# EAGLE board ElektorLinuxBoard_V3.01 (EAGLE 6.4)
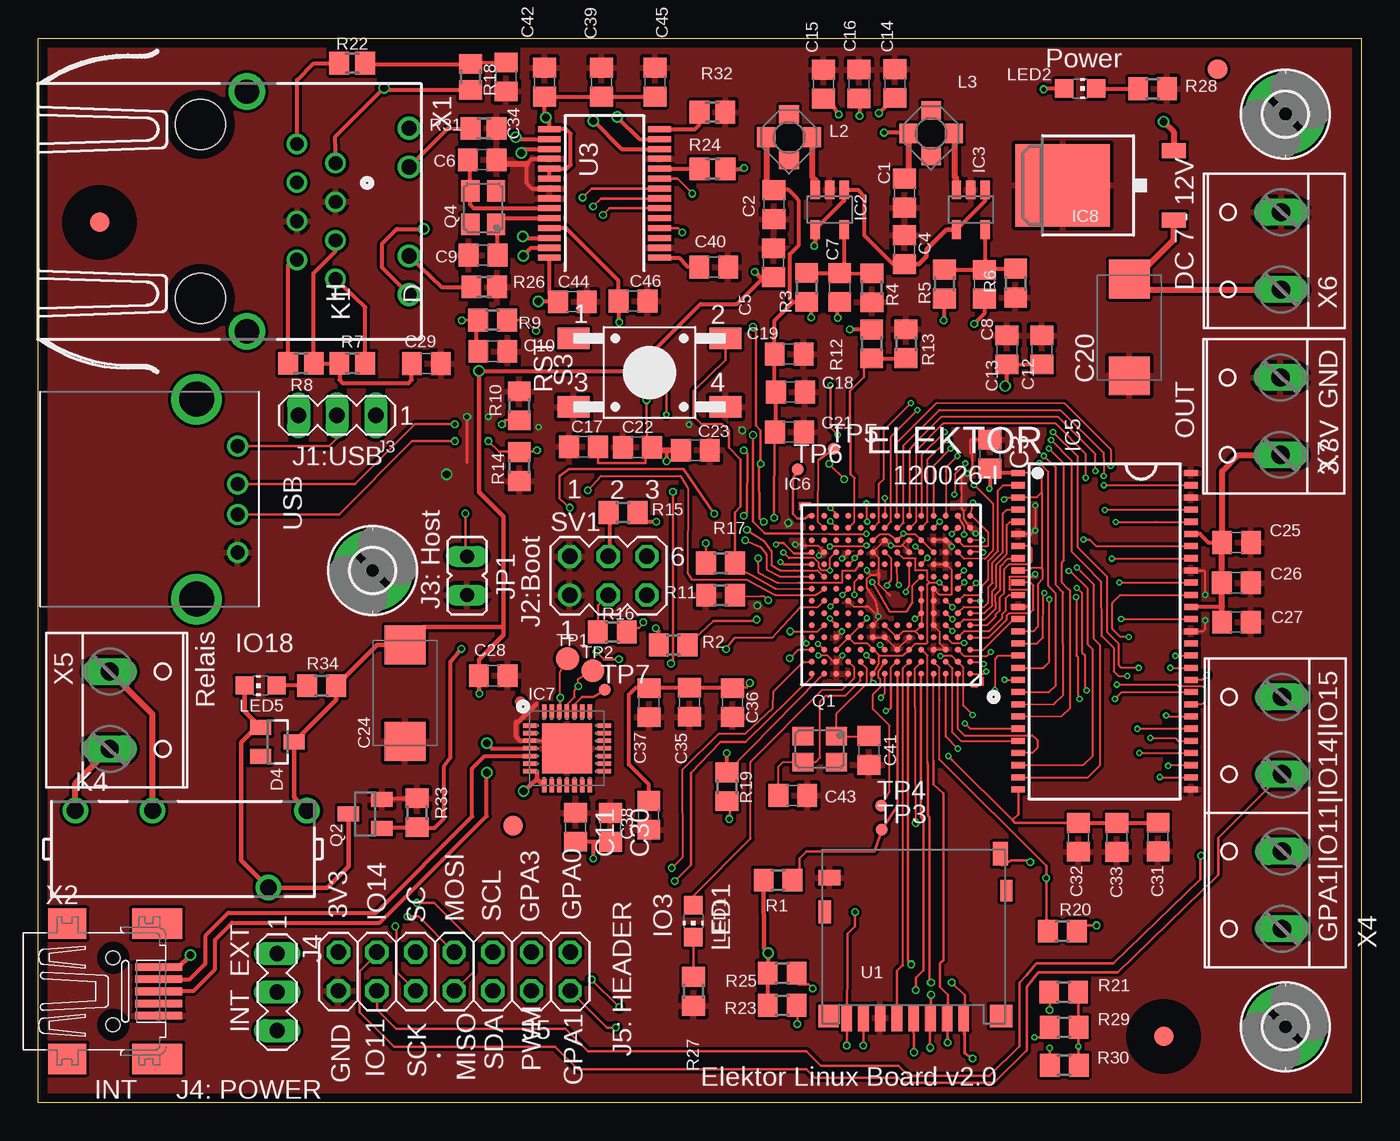
[diagram p3: board, top side]
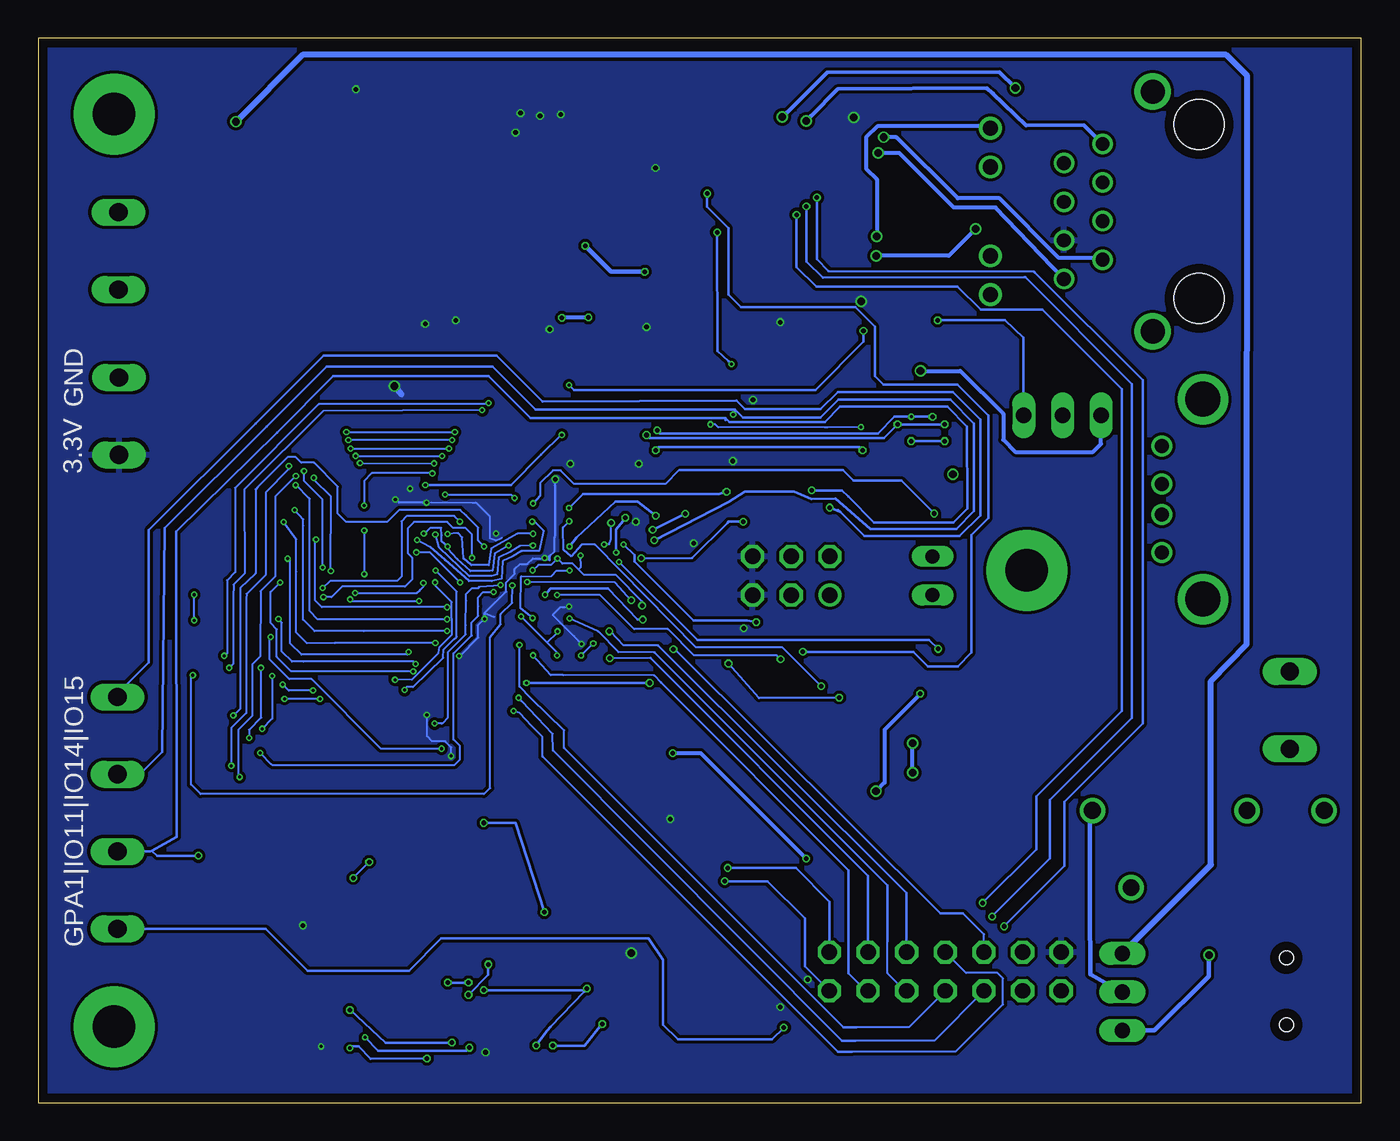
[diagram p4: board, bottom side, seen from below]

Size 87 x 70 mm. Coordinates in mm from the lower left corner, seen from the top.
Outline: 0,70 87,70 87,0 0,0 0,70
Copper layers (1*16): Top 0.035mm / dielectric 0.1mm / Bottom 0.035mm
Design rules "default *": minimum track width 0.12mm, minimum drill 0.2mm, track to track 0.12mm, track to pad 0.12mm, pad to pad 0.12mm, via to via 0.12mm, smd to smd 0mil, copper to edge 0.6mm, drill to drill 8mil, minimum pad ring 6mil, minimum via ring 4mil, stop-mask expansion 2mil, vias tented up to drill 40mil, thermal gap 10mil
Net classes: 0 default: width 0.2 mm, drill 0.3 mm, clearance 0.2 mm; 1 500mA: width 0.3 mm, drill 0.3 mm, clearance 0.15 mm

## Footprints (pad centres in the part's own frame; a part is rotated, then mirrored left to right if it is on the bottom)
C0805 = smd 1.3 x 1.5: 1 -0.95,0; 2 0.95,0
D/7343-31R = smd 2.55 x 2.7: + 3.175,0; - -3.175,0
DIODE_SOT23 = smd 1 x 1.4: 1 -0.95,-1.1; 2 0.95,-1.1; 3 0,1.1
PASSERMARKEN_FIDUCIAL = smd 1.27 x 1.27: 1 0,0
2,8-PAD = drill 2.8 pad 5.334 round: B2,8 0,0
TSOT23 = smd 0.622 x 1.22: 1 -0.95,-1.31; 2 0,-1.31; 3 0.95,-1.31; 4 0.95,1.31; 5 -0.95,1.31
TSOPII = smd 0.4 x 0.9: 1 1.03,0.67; 2 1.83,0.67; 3 2.63,0.67; 4 3.43,0.67; 5 4.23,0.67; 6 5.03,0.67; 7 5.83,0.67; 8 6.63,0.67; 9 7.43,0.67; 10 8.23,0.67; 11 9.03,0.67; 12 9.83,0.67; 13 10.63,0.67; 14 11.43,0.67; 15 12.23,0.67; 16 13.03,0.67; 17 13.83,0.67; 18 14.63,0.67; 19 15.43,0.67; 20 16.23,0.67; 21 17.03,0.67; 22 17.83,0.67; 23 18.63,0.67; 24 19.43,0.67; 25 20.23,0.67; 26 21.03,0.67; 27 21.83,0.67; 28 21.83,12.03; 29 21.03,12.03; 30 20.23,12.03; 31 19.43,12.03; 32 18.63,12.03; 33 17.83,12.03; 34 17.03,12.03; 35 16.23,12.03; 36 15.43,12.03; 37 14.63,12.03; 38 13.83,12.03; 39 13.03,12.03; 40 12.23,12.03; 41 11.43,12.03; 42 10.63,12.03; 43 9.83,12.03; 44 9.03,12.03; 45 8.23,12.03; 46 7.43,12.03; 47 6.63,12.03; 48 5.83,12.03; 49 5.03,12.03; 50 4.23,12.03; 51 3.43,12.03; 52 2.63,12.03; 53 1.83,12.03; 54 1.03,12.03
TFBGA180 = smd 0.4 x 0.4: A1 -5.2,5.2; A2 -4.4,5.2; A3 -3.6,5.2; A4 -2.8,5.2; A5 -2,5.2; A6 -1.2,5.2; A7 -0.4,5.2; A8 0.4,5.2; A9 1.2,5.2; A10 2,5.2; A11 2.8,5.2; A12 3.6,5.2; A13 4.4,5.2; A14 5.2,5.2; B1 -5.2,4.4; B2 -4.4,4.4; B3 -3.6,4.4; B4 -2.8,4.4; B5 -2,4.4; B6 -1.2,4.4; B7 -0.4,4.4; B8 0.4,4.4; B9 1.2,4.4; B10 2,4.4; B11 2.8,4.4; B12 3.6,4.4; B13 4.4,4.4; B14 5.2,4.4; C1 -5.2,3.6; C2 -4.4,3.6; C3 -3.6,3.6; C4 -2.8,3.6; C5 -2,3.6; C6 -1.2,3.6; C7 -0.4,3.6; C8 0.4,3.6; C9 1.2,3.6; C10 2,3.6; C11 2.8,3.6; C12 3.6,3.6; C13 4.4,3.6; C14 5.2,3.6; D1 -5.2,2.8; D2 -4.4,2.8; D3 -3.6,2.8; D4 -2.8,2.8; D5 -2,2.8; D6 -1.2,2.8; D7 -0.4,2.8; D8 0.4,2.8; D9 1.2,2.8; D10 2,2.8; D11 2.8,2.8; D12 3.6,2.8; D13 4.4,2.8; D14 5.2,2.8; E1 -5.2,2; E2 -4.4,2; E3 -3.6,2; E4 -2.8,2; E5 -2,2; E6 -1.2,2; E7 -0.4,2; E8 0.4,2; E9 1.2,2; E10 2,2; E11 2.8,2; E12 3.6,2; E13 4.4,2; E14 5.2,2; F1 -5.2,1.2; F2 -4.4,1.2; F3 -3.6,1.2; F4 -2.8,1.2; F5 -2,1.2; F10 2,1.2; F11 2.8,1.2; F12 3.6,1.2; F13 4.4,1.2; F14 5.2,1.2; G1 -5.2,0.4; G2 -4.4,0.4; G3 -3.6,0.4; G4 -2.8,0.4; G5 -2,0.4; G10 2,0.4; G11 2.8,0.4; G12 3.6,0.4; G13 4.4,0.4; G14 5.2,0.4; H1 -5.2,-0.4; H2 -4.4,-0.4; H3 -3.6,-0.4; H4 -2.8,-0.4; H5 -2,-0.4; H10 2,-0.4; H11 2.8,-0.4; H12 3.6,-0.4; H13 4.4,-0.4; H14 5.2,-0.4; J1 -5.2,-1.2; J2 -4.4,-1.2; J3 -3.6,-1.2; J4 -2.8,-1.2; J5 -2,-1.2; J10 2,-1.2; J11 2.8,-1.2; J12 3.6,-1.2; J13 4.4,-1.2; J14 5.2,-1.2; K1 -5.2,-2; K2 -4.4,-2; K3 -3.6,-2; K4 -2.8,-2; K5 -2,-2; K6 -1.2,-2; K7 -0.4,-2; K8 0.4,-2; K9 1.2,-2; K10 2,-2; K11 2.8,-2; K12 3.6,-2; K13 4.4,-2; K14 5.2,-2; L1 -5.2,-2.8; L2 -4.4,-2.8; L3 -3.6,-2.8; L4 -2.8,-2.8; L5 -2,-2.8; L6 -1.2,-2.8; L7 -0.4,-2.8; L8 0.4,-2.8; L9 1.2,-2.8; L10 2,-2.8; L11 2.8,-2.8; L12 3.6,-2.8; L13 4.4,-2.8; L14 5.2,-2.8; M1 -5.2,-3.6; M2 -4.4,-3.6; M3 -3.6,-3.6; M4 -2.8,-3.6; M5 -2,-3.6; M6 -1.2,-3.6; M7 -0.4,-3.6; M8 0.4,-3.6; M9 1.2,-3.6; M10 2,-3.6; M11 2.8,-3.6; M12 3.6,-3.6; M13 4.4,-3.6; M14 5.2,-3.6; N1 -5.2,-4.4; N2 -4.4,-4.4; N3 -3.6,-4.4; N4 -2.8,-4.4; N5 -2,-4.4; N6 -1.2,-4.4; N7 -0.4,-4.4; N8 0.4,-4.4; N9 1.2,-4.4; N10 2,-4.4; N11 2.8,-4.4; N12 3.6,-4.4; N13 4.4,-4.4; N14 5.2,-4.4; P1 -5.2,-5.2; P2 -4.4,-5.2; P3 -3.6,-5.2; P4 -2.8,-5.2; P5 -2,-5.2; P6 -1.2,-5.2; P7 -0.4,-5.2; P8 0.4,-5.2; P9 1.2,-5.2; P10 2,-5.2; P11 2.8,-5.2; P12 3.6,-5.2; P13 4.4,-5.2; P14 5.2,-5.2
MLP28 = smd 0.9 x 0.3: 1 -2.45,1.5; 2 -2.45,1; 3 -2.45,0.5; 4 -2.45,0; 5 -2.45,-0.5; 6 -2.45,-1; 7 -2.45,-1.5; 15 2.45,-1.5; 16 2.45,-1; 17 2.45,-0.5; 18 2.45,0; 19 2.45,0.5; 20 2.45,1; 21 2.45,1.5 | smd 0.3 x 0.9: 8 -1.5,-2.45; 9 -1,-2.45; 10 -0.5,-2.45; 11 0,-2.45; 12 0.5,-2.45; 13 1,-2.45; 14 1.5,-2.45; 22 1.5,2.45; 23 1,2.45; 24 0.5,2.45; 25 0,2.45; 26 -0.5,2.45; 27 -1,2.45; 28 -1.5,2.45 | smd 3.3 x 3.3: EXP 0,0
DPACK_3 = smd 1 x 1.6: 1 -2.28,-4.8; 3 2.28,-4.8 | smd 5.4 x 6.2: 4 0,2.5
MA03-1 = drill 1.016 long: 1 -2.54,0; 2 0,0; 3 2.54,0
2X07 = drill 1.016 octagon: 1 -7.62,-1.27; 2 -7.62,1.27; 3 -5.08,-1.27; 4 -5.08,1.27; 5 -2.54,-1.27; 6 -2.54,1.27; 7 0,-1.27; 8 0,1.27; 9 2.54,-1.27; 10 2.54,1.27; 11 5.08,-1.27; 12 5.08,1.27; 13 7.62,-1.27; 14 7.62,1.27
JP1 = drill 0.914 long: 1 0,-1.27; 2 0,1.27
61400416021 = drill 0.92 round: 1 -3.5,2.7; 2 -1,2.7; 3 1,2.7; 4 3.5,2.7 | drill 2.3 round: 5 -6.57,0; 6 6.57,0
RELAY_G6D = drill 1.1 pad 1.676 round: 1 8.08,2.5; 5 -2.08,2.5; 7 -7.16,2.5; 13 5.54,-2.58
PSU3014 = smd 1.2 x 1.3: 1 -1.5,0; 2 1.5,0 | smd 1.3 x 1.2: 3 0,1.5; 4 0,-1.5
CHIP-LED0805 = smd 1.2 x 1.2: A 0,-1.05; C 0,1.05
SX-32 = smd 1.4 x 1.2: 1 -1.1,-0.85; 2 1.1,-0.85; 3 1.1,0.85; 4 -1.1,0.85
TRANSISTOR-SMALL-SIGNAL_SOT23 = smd 1 x 1.4: 1 -0.95,-1.1; 2 0.95,-1.1; 3 0,1.1
R0805 = smd 1.3 x 1.5: 1 -0.95,0; 2 0.95,0
R0805' = smd 1.3 x 1.5: 1 -0.85,0; 2 0.85,0
TASTER-9314_SMD = smd 2.1 x 1.4: 1 -5,2.25; 2 5,2.25; 3 -5,-2.25; 4 5,-2.25
MA03-2 = drill 1.016 round: 1 -2.54,-1.27 | drill 1.016 octagon: 2 -2.54,1.27; 3 0,-1.27; 4 0,1.27; 5 2.54,-1.27; 6 2.54,1.27
TP15R = smd 1.5 x 1.5: TP 0,0
TP08R = smd 0.8 x 0.8: TP 0,0
DM3D-SF = smd 0.7 x 1.75: 1 7.7,-0.875; 2 6.6,-0.875; 3 5.5,-0.875; 4 4.4,-0.875; 5 3.3,-0.875; 6 2.2,-0.875; 7 1.1,-0.875; 8 0,-0.875 | smd 1.3 x 1.5: P$1 -1.2,-0.75 | smd 1.5 x 1.5: P$10 10.15,-0.75 | smd 0.8 x 1.4: P$11 10.5,7.5 | smd 0.8 x 1.5: P$13 -1.45,6.1 | smd 1 x 1.55: SW_A 10.1,9.925 | smd 1.45 x 1: SW_B -1.125,8.35
SSOP28 = smd 0.4 x 1.5: 1 -4.225,-3.625; 2 -3.575,-3.625; 3 -2.925,-3.625; 4 -2.275,-3.625; 5 -1.625,-3.625; 6 -0.975,-3.625; 7 -0.325,-3.625; 8 0.325,-3.625; 9 0.975,-3.625; 10 1.625,-3.625; 11 2.275,-3.625; 12 2.925,-3.625; 13 3.575,-3.625; 14 4.225,-3.625; 15 4.225,3.625; 16 3.575,3.625; 17 2.925,3.625; 18 2.275,3.625; 19 1.625,3.625; 20 0.975,3.625; 21 0.325,3.625; 22 -0.325,3.625; 23 -0.975,3.625; 24 -1.625,3.625; 25 -2.275,3.625; 26 -2.925,3.625; 27 -3.575,3.625; 28 -4.225,3.625
J1 = drill 0.9 pad 1.3 round: 1 4.445,2.54; 2 3.175,0; 3 1.905,2.54; 4 0.635,0; 5 -0.635,2.54; 6 -1.905,0; 7 -3.175,2.54; 8 -4.445,0 | drill 1 pad 1.422 round: 9 5.465,7.37; 10 2.925,7.37; 11 -2.925,7.37; 12 -5.465,7.37 | drill 1.6 pad 2.184 round: M1 -7.875,-3.3; M2 7.875,-3.3 | hole 3.3: 5.715,-6.35; -5.715,-6.35
32005-201 = smd 3.1 x 0.5: 1 3,1.6; 2 3,0.8; 3 3,0; 4 3,-0.8; 5 3,-1.6 | smd 2.5 x 2: M1 -3,-4.45; M2 -3,4.45 | smd 3.3 x 2: M3 2.9,4.45; M4 2.9,-4.45 | hole 0.9: 0,2.2; 0,-2.2
W237-4P = drill 1.194 long: 1 -7.62,-0.635; 2 -2.54,-0.635; 3 2.54,-0.635; 4 7.62,-0.635
W237-132 = drill 1.194 long: 1 -2.54,-0.635; 2 2.54,-0.635

## Placement (x,y rotation side)
C1  10uF  [C0805]  56.96,59.8 90 top
C2  10uF  [C0805]  48.37,59.04 90 top
C3  100nF  [C0805]  62.58,42.64 270 top
C4  4.7uF  [C0805]  56.96,56.08 90 top
C5  4.7uF  [C0805]  48.35,55.22 90 top
C6  22pF  [C0805]  29.2,61.99 180 top
C7  22pF  [C0805]  52.7,53.6 90 top
C8  22pF  [C0805]  62.22,53.81 90 top
C9  22pF  [C0805]  29.25,55.72 0 top
C10  100nF  [C0805]  29.9,49.4 180 top
C11  100nF  [C0805]  35.34,18.12 270 top
C12  3.3nF  [C0805]  66,49.5 270 top
C13  10uF  [C0805]  63.7,49.5 270 top
C14  10uF  [C0805]  56.33,67.01 270 top
C15  3.3nF  [C0805]  51.62,66.97 270 top
C16  100nF  [C0805]  53.97,66.98 270 top
C17  3.3nF  [C0805]  35.86,43.13 0 top
C18  100nF  [C0805]  49.47,46.72 180 top
C19  3.3nF  [C0805]  49.38,49.23 180 top
C20  10uF  [D/7343-31R]  71.73,50.97 90 top
C21  10uF  [C0805]  49.39,44.1 180 top
C22  100nF  [C0805]  39.41,43.09 0 top
C23  10uF  [C0805]  43.21,42.9 180 top
C24  10uF  [D/7343-31R]  24.14,26.93 90 top
C25  3.3nF  [C0805]  78.79,36.83 180 top
C26  100nF  [C0805]  78.78,34.19 180 top
C27  10uF  [C0805]  78.78,31.6 180 top
C28  2.2uF  [C0805]  29.92,28.08 0 top
C29  100nF  [C0805]  25.53,48.6 0 top
C30  10uF  [C0805]  37.63,18.11 270 top
C31  3.3nF  [C0805]  73.63,17.47 90 top
C32  10uF  [C0805]  68.39,17.46 90 top
C33  100nF  [C0805]  70.92,17.44 90 top
C34  100nF  [C0805]  30.76,67.44 90 top
C35  100nF  [C0805]  42.82,26.33 90 top
C36  3.3nF  [C0805]  45.66,26.31 90 top
C37  10uF  [C0805]  40.17,26.3 90 top
C38  100nF  [C0805]  40.14,18.9 90 top
C39  100nF  [C0805]  37.04,67.09 90 top
C40  10uF  [C0805]  44.42,54.94 0 top
C41  22pF  [C0805]  54.62,23.17 90 top
C42  100nF  [C0805]  33.3,67.09 90 top
C43  22pF  [C0805]  49.62,20.2 180 top
C44  100nF  [C0805]  35.13,52.66 0 top
C45  100nF  [C0805]  40.56,67.1 90 top
C46  100nF  [C0805]  39.11,52.7 0 top
D4  BAT54  [DIODE_SOT23]  15.74,23.73 270 top
FID1  [PASSERMARKEN_FIDUCIAL]  4.05,57.89 0 top
FID2  [PASSERMARKEN_FIDUCIAL]  74,4.36 0 top
FID3  [PASSERMARKEN_FIDUCIAL]  31.24,18.22 0 top
FID4  [PASSERMARKEN_FIDUCIAL]  77.54,67.95 0 top
H1  MOUNT-PAD-ROUND2.8  [2,8-PAD]  82,5 0 top
H2  MOUNT-PAD-ROUND2.8  [2,8-PAD]  22,35 0 top
H4  MOUNT-PAD-ROUND2.8  [2,8-PAD]  82,65 0 top
IC2  AS1324  [TSOT23]  52.04,58.71 180 top
IC3  AS1324  [TSOT23]  61.32,58.71 180 top
IC5  A43E26161TSOPII  [TSOPII]  63.76,42.43 270 top
IC6  LPC313XFET180  [TFBGA180]  56.07,33.4 180 top
IC7  CP21021  [MLP28]  34.77,23.3 0 top
IC8  MC78M05ABDT  [DPACK_3]  69.86,60.31 90 top
J3  [MA03-1]  19.66,45.19 180 top
J4  [MA03-1]  15.72,7.28 270 top
J5  [2X07]  27.36,8.63 180 top
JP1  [JP1]  28.2,34.65 0 top
K1  61400416021  [61400416021]  10.42,39.68 270 top
K4  G6D-1A-ASI5VDC  [RELAY_G6D]  9.61,16.72 0 top
L2  4u7  [PSU3014]  49.37,63.47 180 top
L3  4u7  [PSU3014]  58.71,63.73 180 top
LED1  ROT  [CHIP-LED0805]  43.08,11.95 180 top
LED2  GRUEN  [CHIP-LED0805]  68.51,66.68 270 top
LED5  GRUEN  [CHIP-LED0805]  14.64,27.43 90 top
Q1  SX-32 - 12 MHz  [SX-32]  51.39,23.25 180 top
Q2  BSS123  [TRANSISTOR-SMALL-SIGNAL_SOT23]  21.51,18.99 90 top
Q4  SX-32 - 25 MHZ  [SX-32]  29.26,58.84 90 top
R1  10K  [R0805]  48.65,14.64 180 top
R2  10K  [R0805]  41.75,30.1 0 top
R3  301K  [R0805]  50.53,53.6 270 top
R4  301K  [R0805]  54.81,53.57 90 top
R5  301K  [R0805]  59.59,53.83 270 top
R6  66K5  [R0805]  64.26,53.88 90 top
R7  49R9  [R0805']  20.66,48.61 0 top
R8  49R9  [R0805']  17.29,48.61 180 top
R9  10K  [R0805]  29.88,51.45 0 top
R10  1M  [R0805]  31.64,45.82 270 top
R11  12K 1%  [R0805]  44.87,33.37 0 top
R12  10K  [R0805]  54.8,49.89 90 top
R13  DNP  [R0805]  57.06,49.9 270 top
R14  1M  [R0805]  31.64,41.83 90 top
R15  10K  [R0805]  38.45,38.8 180 top
R16  10K  [R0805]  37.75,30.95 0 top
R17  10K  [R0805]  44.87,35.48 180 top
R18  49R9  [R0805']  28.44,67.44 90 top
R19  10K  [R0805]  45.29,20.77 90 top
R20  10K  [R0805]  67.33,11.28 180 top
R21  10K  [R0805]  67.42,7.28 180 top
R22  49R9  [R0805']  20.65,68.34 0 top
R23  10K  [R0805]  48.92,6.41 0 top
R24  10K  [R0805']  44.34,61.39 0 top
R25  10K  [R0805]  48.92,8.53 0 top
R26  270R  [R0805']  29.33,53.64 180 top
R27  270R  [R0805]  43.09,7.33 90 top
R28  270R  [R0805]  73.27,66.66 180 top
R29  10K  [R0805]  67.46,4.96 180 top
R30  10K  [R0805]  67.46,2.47 180 top
R31  270R  [R0805']  29.29,64.06 180 top
R32  2.2K/1%  [R0805']  44.33,65.12 180 top
R33  10K  [R0805]  24.92,19.07 270 top
R34  270R  [R0805]  18.64,27.42 0 top
S3  [TASTER-9314_SMD]  40.2,48 0 top
SV1  [MA03-2]  37.49,34.65 0 top
TP1  TPTP15R  [TP15R]  34.81,29.2 0 top
TP2  TPTP15R  [TP15R]  36.46,28.4 0 top
TP3  PTR1TP08R  [TP08R]  55.47,17.96 0 top
TP4  PTR1TP08R  [TP08R]  55.44,19.52 0 top
TP5  TPTP08R  [TP08R]  52.3,42.99 0 top
TP6  TPTP08R  [TP08R]  49.95,41.65 0 top
TP7  TPTP08R  [TP08R]  37.27,27.15 0 top
U1  DM3D-SF  [DM3D-SF]  53.16,6.45 0 top
U3  ENC28J60-SSOP  [SSOP28]  37.24,59.78 90 top
X1  J1011F21P  [J1]  17.02,58.6 270 top
X2  MINI-USB-32005-201  [32005-201]  4.93,7.33 0 top
X4  [W237-4P]  81.14,19.06 90 top
X5  [W237-132]  5.35,25.81 270 top
X6  [W237-132]  81.08,56.01 90 top
X7  [W237-132]  81.04,45.14 90 top

## Tracks (layer width: path | path; a pad name or v marks a point on that pad's centre or on a via)
5V  (via drill 0.3, 0.5)
  Top 0.254: IC3.4 62.27,59.3 IC3.1 | 51.12,57.43 52.99,59.3 IC2.1 53.9,60.02 54.3,59.62 54.3,57.05 56.17,55.18 56.46,55.18 | v28.99,48.11 39.16,48.11 43.56,52.51 45.94,52.51 47.66,54.23
  Top 0.3: 32.8,21.3 33.2,20.9 IC7.8 | 32.8,21.3 32.8,21.7 32.7,21.8 32.4,21.8 IC7.7 | v29,26.9 29,28 C28.1 29,28.2 29,29.15 30.6,30.75 30.6,31.28 30.6,38.53 28.99,40.15 v29,48.1 | v31.92,20.48 32.8,21.3 | v51.02,56.33 51.02,56.53 51.12,56.63 51.12,57.33 51.12,57.43 IC2.4 | v47.12,54.63 47.52,54.23 47.66,54.23 48.32,54.23 C5.1 | 56.46,55.18 56.86,55.18 C4.1
  Top 0.305: 30.6,31.28 25.31,31.28 C24.+ 22.27,30.11 R34.2 19.59,26.48 D4.3 16.84,20.07 K4.1 | IC3.4 59.7,57.4 58.4,56.1 58.4,55.62 57.92,55.14 C4.1
  Bottom 0.254: J3.3 17.12,43.32 17.65,42.79 22.76,42.79 23.55,43.6 23.55,45.3 26.38,48.11 v28.99,48.11 v29,48.1 | v29,26.9 29,26.87 31.35,24.52 31.35,21.05 v31.92,20.48
  Bottom 0.3: v51.02,56.33 49.72,55.03 49.32,54.63 v47.12,54.63 47.02,54.73
  Bottom 0.305: J4.2 15.84,7.34 17.82,8.43 17.87,12.87 17.87,19.04 K4.1
+1V2  (via drill 0.2, 0.3)
  Top 0.125: IC6.D11 IC6.C12 | IC6.D11 IC6.E10 54.48,31.8 v54.49,31.86 | IC6.D11 53.68,30.19 54.51,30.19 54.87,29.83 IC6.C9 54.92,29.8 55.3,29.42 55.28,29.36 | 55.28,29.36 55.28,28.88 IC6.A9 | 55.28,29.36 55.29,29.4 56.81,29.4 57.27,29.77 IC6.C6 57.67,30.19 58.41,30.19 58.48,30.27 58.48,34.12 58.59,34.2 | 58.59,34.2 59.09,34.2 | 59.09,34.2 v59.26,34.21 | v59.26,34.21 IC6.H3 | IC6.L1 v62.12,36.2 v62.13,36.19 | 59.09,34.2 v59.26,34.21 | IC6.L7 56.48,36.19 56.88,35.79 57.05,35.79 57.06,35.79 57.68,35.79 57.68,34.98 58.46,34.98 58.46,34.35 58.59,34.2 | 49.38,35.8 49.39,35.8 51.02,35.8 51.33,35.49 51.33,35.21 51.54,35 v52.06,35 v52.07,35.01 52.07,35.8 IC6.L12
  Top 0.15: 40.1,27.3 C37.2 40.2,27.3 | 42.8,27.3 C35.2 42.9,27.3 | 45.6,27.3 C36.2 45.7,27.3 46.6,27.3 46.6,27.4 v46.8,27.6 | v54.9,27.6 54.8,27.7 54.8,28.1 IC6.A9 | 47.92,60.03 48.32,60.03 C2.2 48.42,60.03 | 47.92,63.43 L2.2 | 48.51,46.89 48.5,46.7 C18.2 | 49.42,53.63 49.42,53.73 | 49.38,35.8 v48.99,36.17 | 49.38,35.8 49.39,35.8 49.38,35.8 | v48.39,38.46 48.4,44 C21.2
  Top 0.254: 40.1,27.3 39.3,27.3 38.84,26.84 38.84,22.23 40.15,20.92 C38.2 | 40.2,27.3 42.8,27.3 | 42.9,27.3 45.6,27.3 | v50.82,51.63 50.81,52.59 50.67,52.66 R3.2 50.07,52.63 49.82,52.63 49.62,52.64 | v52.56,51.61 52.56,52.56 52.63,52.61 C7.1 | 48.42,60.03 49.32,60.03 49.92,59.43 50.02,59.3 50.02,59.03 50.02,56.39 49.42,55.8 49.42,55.17 49.42,54.93 49.42,53.73 | 49.42,53.63 49.42,52.84 49.62,52.64 | 49.62,52.64 48.4,51.42 48.4,50.3 48.4,49.3 48.4,49.23 C19.2 48.43,46.89 48.51,46.89 | C21.2 48.52,44.1 C18.2
  Top 0.406: 47.92,60.03 47.92,63.43
  Bottom 0.125: v62.13,36.19 61.24,36.19 v59.26,34.21 | v52.06,35 52.8,34.99 52.9,34.99 53.25,34.63 55.24,34.61 55.27,32.5 v54.49,31.86
  Bottom 0.15: v46.8,27.6 v54.9,27.6 | v48.99,36.17 49.01,36.31 49.01,36.45 | 49.01,36.45 49.02,36.49 49.01,36.45 | 49.01,36.45 48.99,37.7 v48.39,38.46
  Bottom 0.254: v50.82,51.63 v52.56,51.61
+3V3  (via drill 0.2, 0.3, 0.5)
  Top 0.125: IC6.E8 IC6.D7 56.87,30.99 57.66,30.99 57.67,30.98 | IC6.M2 60.87,36.58 62.42,36.58 62.43,36.59 62.43,37.53 62.34,37.62 61.37,38.59 IC6.P1 v61.47,39.45 | 53.72,35.83 IC6.L10 | 53.72,35.83 IC6.K11 | IC6.C13 v51.28,30.17 | 53.72,35.83 v53.69,35.81 53.6,35.71 53.72,35.83 | 53.72,35.83 54.11,36.22 | IC6.G12 v52.1,32.63 | IC5.1 65.67,41.41 66,41.08 66,40.15 | 66,40.15 65.67,39.82 64.46,39.82 IC5.3 63.64,39.8 v63.51,39.67 | 57.67,30.98 58.05,30.59 IC6.D5 58.06,30.58 IC6.D5 57.67,30.98 | IC5.14 65.43,31 65.73,31.3 65.73,34.12 66.01,34.42 66.01,35.07 65.95,35.15 | 65.95,35.15 65.31,35.15 65.15,34.99 IC5.9 | 66,40.15 66,35.19 65.95,35.15 | 62.87,41.4 C3.2 | IC6.F5 IC6.G5 IC6.H5 IC6.F5 57.72,31.85 57.67,31.85 | IC6.F5 IC6.E5 57.67,30.99 57.67,30.98 | IC6.L4 IC6.M5 57.64,37.39 56.94,37.39 IC6.M7 | IC6.M7 v56.9,37.42 | 77.83,32.13 77.78,36.06 77.81,36.38 C25.2 | IC6.M9 55.35,37.38 55.93,37.39 IC6.M7 | 77.83,32.63 77.8,32.6 | v59.33,29.37 60.07,29.37 60.45,29 IC6.B2 60.83,28.63 60.83,26.11 v61.44,25.5 | v57.65,31.82 57.7,31.82 IC6.F5 | v59.84,22.79 60.1,22.52
  Top 0.15: R30.1 68.4,2.5 v68.4,3.7 68.4,4.9 R29.1 68.4,5 68.4,7.2 R21.1 | 57.26,60.78 57.06,60.78 C1.2 | v45.44,18.66 45.52,19.95 R19.1 | v43.9,36.78 43.9,35.5 R17.2 | v69.59,11.66 68.26,11.65 R20.1 | R5.2 59.56,52.78 | v57.58,3.32 57.57,3.56 U1.4 | R25.1 48,8.6 | v40,46.2 40.02,43.55 C22.2 39.95,43.09 39.95,42.05 36.81,42.05 C17.2 | v47,51 47.2,50.8 47.2,47.7 47.2,47.58 47.19,44.52 47.5,44.21 v47.5,42 47.4,41.89 47.41,38.4 47.61,38.2 v47.7,38.2 | v53,41 v52,42 | v38.2,6.3 v36.4,8.1 | C32.2 65.27,18.41 64.22,18.41 64.05,18.59 | 70.9,18.4 C33.2 71,18.4 | 73.6,18.4 C31.2 | 60.1,22.52 64.05,18.59 | IC5.27 64.43,18.97 64.05,18.59
  Top 0.25: C32.2 70.9,18.4 | 71,18.4 73.6,18.4 | 76.37,37.4 76.96,36.81 77.82,36.81 C25.2
  Top 0.254: v63.57,47.12 63.7,47.29 C13.2 65.79,48.54 | R25.1 48,8.5 48,6.5 R23.1 | v55.61,63.78 57.26,63.78 L3.2 57.26,63.68 | 59.56,52.78 v59.54,51.43 | v61.55,51.21 62.2,51.88 C8.1 | v55.28,65.06 56.28,66.06 C14.2 | v54,64.89 53.99,65.97 C16.2 | v52.63,64.97 51.98,66.02 C15.2 | 48,8.6 v48.01,9.84 | R2.1 40.8,31 v40.6,31.2 | IC5.1 62.87,41.4 | 76.37,37.4 IC5.49 | C3.2 62.58,40.44 62.55,40.41 | 77.8,32.6 IC5.43 | LED2.A 66.15,66.68 v66.1,66.63 | R24.2 46.35,61.39 v46.41,61.45 | C45.1 37.24,66.15 C39.1 C42.1 33.3,64.84 v33.37,64.77 33.61,64.44 U3.15 34.7,64 35.01,63.7 35.01,61.67 34.74,61.4 U3.19 U3.20 | v32.88,52.68 32.9,52.66 C44.1 33.61,53.23 U3.28 | U3.25 34.7,57.51 38.16,54.04 C46.1 38.16,51.36 v38.2,51.32 | R12.2 v53.37,50.84 | v41.32,42.19 41.32,42.86 41.36,42.9 | C29.1 24.57,47.53 24.35,47.31 20.03,47.31 19.81,47.53 R7.1 R8.1 18.11,48.64 18.11,54.53 19.56,55.98 X1.3
  Top 0.305: R1.2 47.71,10.14 v48.01,9.84
  Top 0.406: 65.79,48.54 C12.2 | 57.26,60.78 57.26,63.68 | C22.2 40.36,42.9 41.36,42.9 C23.2 | C27.2 77.83,32.63 C26.2 77.83,36.64 77.78,36.64 77.78,36.83 C25.2 77.84,41.53 78.88,42.57 81.64,42.57 X7.1
  Bottom 0.125: 56.52,37.14 56.89,36.96 57.3,37.1 57.29,38.55 58.18,39.44 58.46,39.44 v61.47,39.45 61.74,39.45 63.28,39.45 v63.5,39.67 v63.51,39.67 | 51.26,30.2 v51.28,30.17 51.76,30.65 51.76,30.66 53.15,32.05 53.15,32.09 52.66,32.58 52.1,32.58 v52.1,32.63 | 63.1,46.57 63.04,46.45 | v53.69,35.81 53.38,35.7 | 53.05,37.15 53.05,36.25 53.4,35.9 v53.69,35.81 | v59.33,29.37 59.27,29.37 58.06,30.58 IC6.E5 v57.65,31.82 v57.64,31.83 57.64,32.2 | v61.44,25.5 61.44,24.11 61.1,23.77 60.24,23.77 59.84,23.37 v59.84,22.79 | 57.64,32.2 57.02,31.94 | 57.64,32.2 56.23,33.61 56.23,34.21 55.66,34.78 55.66,35.08 55.32,35.42 54.84,35.42 54.47,35.79 53.71,35.79 v53.69,35.81
  Bottom 0.15: 53.38,35.7 53.4,35.9 53.38,35.89 | v53,41 53,37.3 53.05,37.15
  Bottom 0.406: v63.57,47.12 63.1,46.57
  other vias: 62.55,40.37
  pour Bottom: 14.77,72.83 90.51,72.83 90.51,-5.33 -8.97,-5.02 -8.97,73.13
EXT_5V  (via drill 0.5)
  Top 0.406: IC8.3 74.66,63.83 v73.99,64.5
  Bottom 0.406: v73.99,64.5 v73.99,64.51 69.61,68.9 8.89,68.9 7.52,67.51 7.55,31.28 7.54,30.99 7.54,30.15 9.89,27.72 9.89,15.65 J4.1
GND  (via drill 0.2, 0.3, 0.5)
  Top 0.125: IC6.E4 IC6.F4 IC6.G4 IC6.H4 59.24,33.43 60.07,33.43 60.07,35.02 59.7,35.4 IC6.K3 IC6.K4 | IC6.D6 56.57,29.89 56.5,29.89 56.47,29.86 IC6.C7 IC6.D8 IC6.D9 | IC6.E4 | v55.25,31.97 55.25,31.77 IC6.E9 | IC6.G11 53.27,32.97 53.64,32.6 54.62,32.6 v55.25,31.97 | v52.89,29.41 IC6.B12 52.3,29 51.9,29.4 v51.3,29.4 | IC6.D12 52.47,30.62 v52.85,31 | v61.64,37.43 IC6.N1 60.88,38.42 60.88,38.92 60.73,39.07 60.73,41.09 61.02,41.38 v61.08,41.38 | v60.07,36.58 60.07,36.6 | v49.78,36.7 50.26,36.7 50.4,36.59 51.31,36.59 IC6.L13 51.62,36.2 v51.33,35.98 | v49.33,38.12 49.34,38.09 49.21,37.83 | 55.27,34.87 55.27,35.82 IC6.L9 IC6.M8 56.07,36.6 56.1,36.6 56.73,36.6 56.81,36.68 | 55.27,34.87 55.25,34.83 55.24,34.11 56.02,33.33 56.03,33.33 | 55.27,34.87 55.25,34.11 | 55.27,34.87 55.07,34.69 54.75,34.69 | 54.75,34.69 54.47,34.42 54.47,33.89 55.05,32.99 v55.25,31.97 | IC6.L11 v52.87,35.79 v52.86,35.79 | v47.29,32.69 47.29,32.66 | 56.81,36.68 57.12,36.99 IC6.M6 | v42.8,44.6 42.89,44.6 | IC5.12 65.01,32.6 65.13,32.72 65.13,33.74 65.12,33.75 63.87,33.75 63.85,33.77 63.85,34.57 63.86,34.58 65.38,34.58 v65.55,34.75 | IC5.41 76.59,31 76.74,31.15 v76.74,31.71 v76.73,31.72 | v76.73,33.4 76.73,34.94 76.71,34.96 75.83,34.96 IC5.46 | IC6.C4 IC6.C3 59.28,30.19 59.28,30.96 58.87,31.37 IC6.E4 | 65.34,37.4 IC5.6 65.32,37.4 v65.55,37.63 v65.56,37.64 v65.56,39.27 | IC6.M3 IC6.M4 | v54.48,35.01 54.58,34.86 54.75,34.69 | IC6.L6 57.27,36.22 56.81,36.68
  Top 0.15: 32.3,23.8 IC7.3 32.4,23.8 33.7,23.8 33.7,23.4 33.8,23.3 34.7,23.3 IC7.EXP | v56.06,36.63 56.1,36.6 56.07,36.6 | v46.3,44.2 46.1,44.4 | 28.2,42.1 v28.2,45.1 | C3.1 61.37,43.59 61.29,43.51 61.29,42.72 61.41,42.6 61.41,41.71 v61.08,41.38 | IC6.L11 53.26,36.2
  Top 0.254: R33.1 22.7,20.02 Q2.2 | U3.21 32.48,60.1 32.12,60.46 32.12,61.7 32.48,62.06 U3.18 | 30.44,61.7 C6.1
  Top 0.305: 60.07,36.6 IC6.M3 | IC7.3 31.69,23.8 31.41,24.08 31.41,25.03 31.43,25.05 31.6,25.05 32.76,26.21
  Top 0.406: 32.12,61.7 30.44,61.7
  Bottom 0.125: v52.89,29.41 52.89,29.61 53.53,30.25 | v55.25,31.97 53.53,30.25 | v52.85,31 52.85,30.93 53.53,30.25 | v61.64,37.43 61.59,37.43 61.23,37.78 60.5,37.8 60.46,37.31 60.46,36.9 v60.07,36.58 60.07,36.45 59.45,35.75 58.57,34.96 57.29,34.97 57.13,34.99 56.98,36.12 v56.06,36.63 | v49.78,36.7 49.46,36.72 49.37,36.97 49.34,37.07 v49.33,38.12 | 51.48,35.08 51.1,34.7 49.15,34.7 49.01,34.7 47.29,32.96 v47.29,32.69 | 51.48,35.08 51.85,35.45 52.52,35.45 v52.86,35.79 v52.86,35.78 53.27,35.37 54.1,35.37 v54.48,35.01 | v51.3,29.4 v50.5,30.2 | v32.9,44.42 35.08,44.4 35.3,44.4 42.3,44.41 42.5,44.61 v42.8,44.6 | v65.55,34.75 65.55,37.05 v65.55,37.63 | v76.73,31.72 v76.73,33.4 | v61.08,41.38 v61.09,41.39 65.06,41.39 65.56,40.89 v65.56,39.27 | v51.33,35.98 51.32,35.23 51.48,35.08
  Bottom 0.15: v46.3,44.2 46.1,44 31.8,44 30.7,45.1 v29.6,45.1 v28.2,45.1
  other vias: 26.86,41.31
  pour Top: 17.75,73.53 91.92,73.53 91.92,-6.08 -5.39,-4.95 -5.39,74.67
GPA0  (via drill 0.3)
  Top 0.125: IC6.B14 50.28,29 48.33,27.04 48.3,25.96 46.51,24.27 44.75,24.27 42.38,21.93 42.39,16.16 v41.67,15.44
  Bottom 0.15: v41.67,15.44 37.19,15.44 34.96,13.21 34.96,9.92 J5.1
GPA1  (via drill 0.3)
  Top 0.15: IC6.A14 50.87,28 46.51,23.71 44.86,23.71 42.91,21.69 42.91,15.63 v41.85,14.57 | v37.97,4.94 37.4,4.94 J5.2
  Bottom 0.15: v41.85,14.57 39.05,14.57 36.6,12.12 36.6,8.98 J5.2 | X4.1 72.03,11.44 69.28,8.69 62.62,8.69 60.51,10.8 46.87,10.8 45.9,9.41 45.9,5.12 44.94,4.16 38.75,4.16 v37.97,4.94
GPA3  (via drill 0.3)
  Top 0.125: IC6.C14 49.99,29.8 v49.42,29.22
  Bottom 0.125: 46.75,29.24 v49.42,29.22
  Bottom 0.15: 46.75,29.24 32.44,14.93 J5.3
GPIO0  (via drill 0.3)
  Top 0.125: IC6.K10 54.07,35.44 53.75,34.99 52.88,34.99 52.87,34.19 50.02,34.19 48.65,34.18 47.33,34.87 47.32,35.49
  Top 0.15: v47.34,35.79 47.32,35.49 | R15.1 39.55,38.2
  Top 0.254: 39.55,38.2 v40.65,38.2
  Bottom 0.125: 41.6,38.2 41.67,38.12
  Bottom 0.15: v47.34,35.79 44,35.8 41.67,38.12 | 41.6,38.2 41.67,38.12 | 41.6,38.2 41.67,38.12 | v40.65,38.2 41.6,38.2
GPIO2  (via drill 0.2, 0.3)
  Top 0.15: v48.5,36.7 48.6,36.8 48.99,36.8 49.69,36.1 50.8,36.1 IC6.L14 | v39.79,31.6 39.74,31.46 39.5,31.2 39.2,31.2 38.8,31.6 38.7,31.6 38.7,31 R16.2
  Bottom 0.15: v48.5,36.7 47.8,36 47.8,35.6 43.9,31.7 40.4,31.7 v39.79,31.6
GPIO11  (via drill 0.3)
  Top 0.125: 51.67,33.74 51.1,33.4 48.45,33.4 46.58,34.4 42.96,34.4 42.69,34.83 42.73,40.38 42.23,41.21 37.01,41.21 v36.14,40.26
  Top 0.15: 51.67,33.74 IC6.H13 | J5.12 22.28,6.11 23.54,4.85 34.69,4.85 36.14,3.4 50.5,3.4 51.46,2.44 56.56,2.44 57.24,1.77 62.55,1.77 64.51,3.71 64.51,7.88 64.98,8.38 65.63,9.16 70.7,9.16 76.42,14.7 76.42,16.2 v76.46,16.24
  Bottom 0.15: X4.2 79.62,16.52 79.52,16.58 | 79.52,16.58 77.9,17.47 77.92,37.56 71.29,44.07 67.6,47.76 57.37,47.76 54.61,45 54.54,45 41.81,45.01 | 41.81,45.01 41.55,44.75 35.28,44.76 34.3,45.76 27.22,45.76 25.93,44.47 25.92,39.08 26.84,38.16 32.05,38.16 33.73,39.84 34.15,40.26 v36.14,40.26 | v76.46,16.24 79.18,16.24 79.52,16.58 | 41.81,45.01 41.81,44.89
GPIO14  (via drill 0.2, 0.3)
  Top 0.125: IC6.J14 50.01,34.6 48.76,34.59 47.89,35.06 47.88,36.03 47.48,36.55 v46.5,36.98
  Top 0.15: J5.11 22.28,9.8 21.13,8.65 21.13,5.96 23.41,3.68 34,3.68 35.49,2.19 50.5,2.19 51.06,1.64 56.55,1.65 56.87,1.31 62.85,1.31 65.01,3.45 65.01,7.64 65.77,8.57 71,8.57 77.59,14.99 77.59,17.41 X4.3 | U3.4 42.09,57.51 v42.36,57.23 | v41.3,45.25 41.3,48.45 v41.42,48.57
  Bottom 0.15: X4.3 80.31,21.6 78.83,23.08 78.69,37.8 71.96,44.47 68.02,48.41 57.13,48.41 54.29,45.57 54.21,45.57 41.17,45.57 | 41.17,45.57 40.66,45.06 35.55,45.06 34.39,46.22 27.03,46.22 25.48,44.67 25.47,38.89 26.63,37.73 32.29,37.72 34.58,39.73 36.15,39.7 37.31,40.19 40.51,40.17 41.61,39.48 v46.5,36.98 | v42.36,57.23 42.35,49.42 41.62,48.75 41.51,48.64 v41.42,48.57 | 41.17,45.57 41.17,45.38 v41.3,45.25
GPIO15  (via drill 0.3)
  Top 0.125: IC6.J13 51.25,35.01 49.75,35.01 48.82,35.01 48.21,35.34 48.21,36.23 47.68,36.95 v46.6,37.67
  Top 0.15: v44.45,38.73 42.42,41.67 34.9,41.67 34.29,41.19 34.27,40.96 34.28,39.72 v34.95,39.13
  Bottom 0.15: 81.78,26.91 79.74,28.94 79.72,37.65 72.7,44.65 72.7,44.66 68.24,49.12 56.85,49.12 53.82,46.09 41.07,46.15 40.52,45.6 35.55,45.6 34.43,46.72 26.85,46.72 25.05,44.91 25.06,38.62 26.42,37.26 32.69,37.26 34.26,38.83 | 34.26,38.83 34.4,38.97 | v44.45,38.73 v46.6,37.67 | 34.26,38.83 v34.95,39.13
  Bottom 0.305: 81.78,26.91 X4.4
GPIO18  (via drill 0.2, 0.3)
  Top 0.15: IC6.K14 49.03,35.39 v48.81,35.56
  Top 0.254: v27.82,29.84 27.12,28.99 27.11,22.7 26.69,22.1 26.68,18.71 26.06,18.08 24.98,18.07 | R33.2 22.71,18.11 Q2.1
  Top 0.305: R33.2 24.98,18.07
  Bottom 0.15: v48.81,35.56 43.64,30.43 28.45,30.43 | 28.45,30.43 v27.82,29.84 28.45,30.43
GPIO19  (via drill 0.2, 0.3)
  Top 0.125: IC6.H11 53.27,33.77 v52.89,33.39
  Top 0.15: U3.9 42.02,60.76 v43.01,59.77 | v38.19,29.16 37.21,29.16 v36.72,29.65
  Bottom 0.125: v52.89,33.39 50.06,33.39 47.81,31.14 45.6,31.14 43.89,29.42 38.45,29.42 v38.19,29.16
  Bottom 0.15: v43.01,59.77 43.01,58.9 41.61,57.5 41.61,53.13 40.8,52.32 33.27,52.32 31.97,51.02 31.97,47.76 31.44,47.23 26.57,47.23 24.52,45.18 24.52,38.43 25.63,37.32 25.63,29.6 26.53,28.7 28.51,28.7 29.46,29.65 v36.72,29.65
I2C_SCL  (via drill 0.3)
  Top 0.125: IC6.E13 51.25,30.99 v49.45,30.99
  Bottom 0.125: v49.45,30.99 49.35,30.98 48.5,30.08 46.23,30.08
  Bottom 0.15: 46.23,30.08 29.9,13.8 J5.5
I2C_SDA  (via drill 0.2)
  Top 0.125: IC6.E12 v52.07,31.83
  Bottom 0.125: v52.07,31.83 50.17,30.98 48.84,29.63 46.48,29.61 | 31.16,10.63 31.16,8.52 30,7.36 J5.6
  Bottom 0.15: 46.48,29.61 31.16,14.31 31.16,10.63
LED1
  Top 0.125: IC6.B11 53.66,28.61 53.66,27.93 52.87,27.16 51.54,27.15 46.85,22.4 46.85,17.37 43.08,13.6 LED1.A
LINKACT
  Top 0.254: R26.2 26.52,53.64 X1.10
LPC_A0
  Top 0.125: IC5.23 60.66,23.8 60.11,24.35 60.11,28.56 IC6.B3
LPC_A1
  Top 0.125: IC5.24 65.36,23 65.68,23.32 65.68,23.84 65.36,24.16 60.89,24.16 60.47,24.58 IC6.A2
LPC_A2  (via drill 0.2)
  Top 0.125: IC5.25 68.72,22.2 69.34,22.82 69.33,29.8 69,30.14 69,33.8 67.85,34.94 v67.75,34.95 | IC6.N6 57.31,37.8 57.7,38.18 57.7,42.79 57.7,42.85 59.49,44.64 66.91,44.64 68.88,42.66 v68.88,41.1 v68.87,41.09
  Bottom 0.125: v68.87,41.09 68.87,40.98 67.74,39.84 v67.75,34.95
LPC_A3  (via drill 0.2)
  Top 0.125: IC5.26 69.03,21.4 69.83,22.2 69.83,29.89 69.83,30.06 69.41,30.48 69.41,34.07 v68.3,35.18 | IC6.P6 57.27,42.75 57.27,42.93 57.64,43.36 59.36,45.08 67.06,45.08 69.52,42.64 v69.52,41.54
  Bottom 0.125: v68.3,35.18 68.3,39.65 69.52,40.88 69.52,41.49 v69.52,41.54
LPC_A4  (via drill 0.2)
  Top 0.125: IC5.29 73.76,21.4 v73.75,21.41 | IC6.N7 56.55,37.8 56.9,38.14 56.89,43.05 56.89,43.22 59.24,45.55 67.2,45.54 70.04,42.75 70.05,41.98 v70.05,41.2
  Bottom 0.125: v73.75,21.41 73.75,21.46 73.83,21.54 73.83,24.52 72.91,25.44 72.91,28.83 72.4,29.34 72.38,33.64 71.41,34.61 71.4,39.86 v70.05,41.2
LPC_A5  (via drill 0.2)
  Top 0.125: IC5.30 74.33,22.2 v74.29,22.16 | IC6.P7 56.47,40.55 56.47,43.29 56.47,43.42 59.09,46.02 67.47,46 70.51,42.96 v70.51,41.85
  Bottom 0.125: v74.29,22.16 74.29,24.64 73.31,25.62 73.31,33.16 73.3,33.45 72.02,34.71 72.02,40.12 70.51,41.66 v70.51,41.85
LPC_A6  (via drill 0.2)
  Top 0.125: IC5.31 73.23,23 v72.39,23 | IC6.K6 57.27,34.02 v57.06,33.58
  Bottom 0.125: v72.39,23 72.38,22.97 71.66,22.25 71.58,22.19 59.66,22.19 59.26,22.59 59.26,23.45 59.69,23.88 59.69,29.54 58.49,30.72 | v57.06,33.58 57.73,33.57 58.07,33.23 58.06,32.66 58.06,32.02 58.49,31.59 58.49,30.72 | 58.49,30.72 58.48,30.74 58.49,30.72 | 58.49,30.72 58.48,30.71 58.49,30.72
LPC_A7  (via drill 0.2)
  Top 0.125: IC5.32 74.94,23.8 74.76,23.98 v73.13,23.98 | v72.35,28.6 71.23,28.6 71.05,28.78 71.05,30.15 70.28,30.92 70.28,34.58 68.36,36.5 68.36,42.47 v66.73,44.1 | IC6.P5 58.08,42.47 58.08,42.58 v59.6,44.1
  Bottom 0.125: v73.13,23.98 73.13,24.52 72.33,25.32 72.33,28.58 v72.35,28.6 | v66.73,44.1 v59.6,44.1
LPC_A8  (via drill 0.2)
  Top 0.125: IC5.33 v72.28,24.6 v72.27,24.59 | v71.6,28.07 71.01,28.07 70.71,28.37 70.71,29.9 69.89,30.72 69.88,34.28 68.83,35.34 67.93,36.24 67.93,42.21 v66.6,43.56 | IC6.N5 58.48,38.2 58.48,42 58.48,42.28 v59.77,43.56
  Bottom 0.125: v72.27,24.59 71.6,25.26 v71.6,28.07 | v59.77,43.56 v66.6,43.56
LPC_A9  (via drill 0.2)
  Top 0.125: IC5.34 74.22,25.4 v74.16,25.46 | IC6.L5 58.03,36.2 v57.67,36.56
  Bottom 0.125: v74.16,25.46 v74.15,25.46 73.72,25.89 73.71,33.69 73.71,33.85 72.71,34.8 72.71,40.32 72.56,40.49 70.58,42.46 70.07,42.46 69.69,42.08 68.86,42.08 67.29,40.51 67.29,38.73 66.75,38.19 64.04,38.19 63.26,38.98 59.24,38.98 58.86,38.61 58.06,37.81 58.06,36.97 57.67,36.58 v57.67,36.56
LPC_A10  (via drill 0.2)
  Top 0.125: v56.59,34.03 56.48,34.14 IC6.K7 | IC5.22 61.26,24.6 v60.93,24.93
  Bottom 0.125: v56.59,34.03 57.97,33.93 58.05,33.85 58.46,33.83 58.86,33.46 58.86,33.02 58.88,31.39 58.88,30.8 60.03,29.65 60.05,25.33 60.42,24.94 60.47,24.93 60.48,24.93 v60.93,24.93
LPC_A11  (via drill 0.2)
  Top 0.125: IC5.35 76.51,26.2 76.72,26.41 76.72,27.21 76.54,27.39 74.96,27.39 74.85,27.5 74.84,27.49 v70.91,27.49 | IC6.N4 v59.27,38.2 | v68.3,33.85 v68.3,33.84 68.63,33.52 68.63,29.62 68.8,29.44 68.8,27.23 v68.93,27.1
  Bottom 0.125: v59.27,38.2 v59.27,38.21 59.64,38.58 62.76,38.58 63.11,38.23 63.11,34.59 63.39,34.31 67.79,34.31 v68.3,33.85 | v68.93,27.1 70.52,27.1 v70.91,27.49
LPC_A12  (via drill 0.2)
  Top 0.125: IC6.K5 58.07,35.43 v58.47,35.83 | IC5.36 71.24,27 v70.8,26.56 | v68.47,26.55 v68.46,26.55 68.37,26.64 68.37,29.28 68.25,29.4 v68.25,33.23 v68.24,33.24
  Bottom 0.125: v58.47,35.83 58.47,37.35 58.91,37.79 59.7,37.79 60.1,38.19 62.28,38.19 62.7,37.77 62.7,36.13 62.41,35.84 62.41,34.39 62.87,33.93 67.02,33.93 67.71,33.24 v68.24,33.24 | v70.8,26.56 v68.48,26.56 v68.47,26.55
LPC_A13  (via drill 0.2)
  Top 0.125: IC5.21 67.3,25.42 67.85,25.97 67.85,33.07 67.85,33.65 67.68,33.82 67.29,34.21 67.3,35.5 67.44,35.67 67.44,42.02 v66.44,43.02 | IC6.P4 58.87,41.85 58.91,41.92 v59.99,43
  Bottom 0.125: v66.44,43.02 v59.99,43
LPC_A14  (via drill 0.2)
  Top 0.125: IC5.20 66.79,26.21 67.39,26.81 67.38,33.47 67.38,33.56 66.92,34.03 66.92,41.75 v66.13,42.53 | IC6.P3 59.68,41.51 59.68,41.75 59.73,41.81 v60.43,42.51
  Bottom 0.125: v66.13,42.53 v60.43,42.51
LPC_A15
  Top 0.125: IC6.N3 59.7,37.8
LPC_CAS  (via drill 0.2)
  Top 0.125: IC5.17 66.09,28.6 66.48,28.99 v66.48,33.1 | v61.96,32.99 IC6.G1
  Bottom 0.125: v66.48,33.1 66.39,32.99 v61.96,32.99
LPC_CKE  (via drill 0.2)
  Top 0.125: IC5.37 76.52,27.8 v76.82,28.11 | IC6.L8 56.1,35.77 56.1,34.38 v55.82,34
  Bottom 0.125: v76.82,28.11 76.94,28.04 76.94,27.71 76.94,20.92 76.32,20.3 57.68,20.3 57.28,20.7 57.28,30.6 56.59,31.46 56.59,32.13 55.83,32.87 v55.82,34
LPC_CLK  (via drill 0.2)
  Top 0.125: IC5.38 v74.44,28.6 | IC6.N8 56.07,38.2 56.07,43.8 56.32,44.05 v57.8,45.53
  Bottom 0.125: v74.44,28.6 74.16,28.86 74.16,33.24 74.14,34.07 73.43,34.79 73.44,40.32 68.26,45.47 v57.8,45.53
LPC_CS  (via drill 0.2)
  Top 0.125: v55.67,39.76 IC6.P8 | IC5.19 66.46,27 66.92,27.45 66.91,33.37 66.91,33.47 66.42,33.96 66.42,41.47 v65.84,42.05 | v60.97,42.04 60.26,41.33 60.26,40.01 v60.23,39.98
  Bottom 0.125: 55.67,39.59 v55.67,39.76 55.89,39.98 v60.23,39.98 | v65.84,42.05 v60.97,42.04
LPC_D0
  Top 0.125: IC5.2 63.46,40.6 63.1,40.24 63.1,36.26 62.46,35.62 62.46,34.39 62.06,33.97 62.06,33.57 61.87,33.4 60.89,33.4 60.48,32.99 IC6.G2
LPC_D1
  Top 0.125: 60.47,32.22 IC6.F2 60.47,32.23 60.85,32.61 62.19,32.61 62.47,32.89 62.47,33.9 62.74,34.17 62.74,35.53 | IC5.4 63.68,39 63.42,38.74 63.43,36.21 | 62.74,35.53 63.43,36.21 | 62.74,35.53 63.43,36.21
LPC_D2
  Top 0.125: IC5.5 63.88,38.2 63.68,38 63.68,36.08 63,35.38 63,33.91 62.95,33.86 62.74,33.65 62.74,32.71 62.23,32.2 IC6.F1
LPC_D3
  Top 0.125: IC5.7 65.15,36.6 65.32,36.43 65.32,35.57 65.16,35.41 63.84,35.41 63.52,35.08 63.52,33.52 63.24,33.25 63.24,32.39 63.22,32.36 62.95,32.09 62.96,31.96 62.88,31.88 62.4,31.4 IC6.E1
LPC_D4
  Top 0.125: IC6.E2 60.47,31.41 60.85,31.79 62.26,31.79 62.96,32.5 62.95,33.4 63.25,33.7 63.26,35.26 63.77,35.77 64.41,35.77 IC5.8
LPC_D5
  Top 0.125: 61.45,30.59 IC6.D1 62.51,30.59 63.69,31.79 63.69,32.06 63.84,32.2 65.21,32.2 65.44,32.43 65.44,34 65.24,34.2 IC5.10
LPC_D6
  Top 0.125: IC6.D2 60.48,30.59 60.91,31.02 62.53,31.02 63.39,31.88 63.39,32.13 63.64,32.37 63.63,33.19 63.83,33.4 IC5.11
LPC_D7
  Top 0.125: IC5.13 64.15,31.8 62.13,29.78 61.29,29.78 IC6.C1
LPC_D8  (via drill 0.2)
  Top 0.125: IC6.B1 62.05,29 v62.19,28.85 | IC5.42 71.21,31.8 v71.2,31.81
  Bottom 0.125: v62.19,28.85 62.19,28.87 62.32,29 69.55,29 | v71.2,31.81 70.97,31.57 70.97,29.67 70.31,29.01 70.3,29 69.55,29 | 69.55,29 69.56,29.01
LPC_D9  (via drill 0.2)
  Top 0.125: IC6.A3 59.67,24.08 v60.47,23.28 | IC5.44 71.15,33.4 70.63,32.88 70.63,31.15 71.15,30.63 71.55,30.63 v71.7,30.62
  Bottom 0.125: v60.47,23.28 64.46,23.28 69.03,27.85 69.04,27.86 70.49,27.86 71.79,29.16 71.79,30.5 71.74,30.61 v71.7,30.62
LPC_D10  (via drill 0.2)
  Top 0.125: IC6.A1 62.16,28.2 v62.33,28.36 | IC5.45 71.09,34.2 v71.08,34.21
  Bottom 0.125: v62.33,28.36 69.76,28.36 69.78,28.36 70.36,28.36 71.3,29.32 71.3,31.12 71.7,31.53 71.71,33.59 v71.08,34.21
LPC_D11  (via drill 0.2)
  Top 0.125: IC6.C2 60.87,29.39 62.39,29.39 v62.63,29.63 | IC5.47 70.63,35.8 v70.6,35.77
  Bottom 0.125: v62.63,29.63 62.63,29.54 62.71,29.46 69.68,29.46 70.43,30.21 70.43,35.66 70.55,35.77 v70.6,35.77
LPC_D12  (via drill 0.2)
  Top 0.125: IC6.G3 v60.12,32.58 | IC5.48 69.56,36.6 69.55,36.61 69.12,37.04 v68.73,37.04
  Bottom 0.125: v60.12,32.58 68.34,32.58 68.79,33.03 68.79,36.98 v68.73,37.04
LPC_D13  (via drill 0.2)
  Top 0.125: IC5.50 73.49,38.2 v70.86,38.19 | IC6.D3 59.72,30.59 60.09,30.22 v60.88,30.22
  Bottom 0.125: v70.86,38.19 70.02,37.06 70.02,34.91 70.02,30.91 69.31,30.21 67.48,30.22 | v60.88,30.22 67.48,30.22 | 67.48,30.22 67.49,30.22 67.48,30.22
LPC_D14  (via drill 0.2)
  Top 0.125: IC5.51 70.16,39 v70.14,38.98 | IC6.E3 59.72,31.39 v60.1,31.01
  Bottom 0.125: v70.14,38.98 69.56,38.35 69.56,37.95 69.58,31.77 68.82,31.01 65.59,31.01 v60.1,31.01
LPC_D15  (via drill 0.2)
  Top 0.125: IC5.53 v70.07,40.6 | IC6.F3 59.7,32.2 v60.1,31.79
  Bottom 0.125: v70.07,40.6 70.02,40.6 69.2,39.76 69.14,39.7 69.16,32.34 68.61,31.79 65.55,31.79 v60.1,31.79
LPC_DM  (via drill 0.2, 0.3)
  Top 0.125: IC6.N2 v60.07,37.4 | 50.02,37.41 52.02,37.4 53.01,37.4 v54.45,37.4 v54.45,37.41
  Top 0.15: v30.5,44.6 30.7,44.8 30.7,44.9 31.6,44.9 R10.2 | v27.4,44.6 v27.4,44.61 24.78,44.61 20.85,40.68 K1.2 | v47,43.9 47,38.2 47.79,37.41 50.02,37.41
  Bottom 0.125: v60.07,37.4 59.39,37.45 59.11,37.17 59.04,35.78 58.53,35.34 57.37,35.35 57.21,36.44 55.48,37.42 v54.45,37.41
  Bottom 0.15: v27.4,44.6 v30.5,44.6 31.4,43.7 46.8,43.7 v47,43.9
LPC_DP  (via drill 0.2, 0.3)
  Top 0.125: IC6.P2 60.89,37.89 60.89,37.43 v60.88,37.35 | v54.47,36.64 54.3,36.59 52.11,36.59 v52.06,36.57
  Top 0.15: v29.6,43.5 30.3,42.8 31.6,42.8 R14.2 31.7,42.8 32.7,42.8 v32.8,42.9 | v46.4,42.9 46.63,42.69 46.62,38.81 v46.4,38.6 | K1.3 19.78,38.68 24.6,43.5 v27.4,43.5
  Bottom 0.125: v60.88,37.35 60.63,36.5 58.65,34.63 57.19,34.64 56.81,34.74 56.71,35.85 55.91,36.23 55.32,36.61 v54.47,36.64
  Bottom 0.15: v27.4,43.5 v29.6,43.5 | v32.8,42.9 33,43.1 46.2,43.1 v46.4,42.9 | v46.4,38.6 47.58,39.53 49.03,39.53 51.61,37.16 v52.06,36.57
LPC_DQM0  (via drill 0.2)
  Top 0.125: IC6.H1 61.3,33.8 v61.67,34.17 | IC5.15 65.68,30.2 66.07,30.59 66.08,33.47 v66.15,33.52
  Bottom 0.125: v61.67,34.17 61.67,33.95 61.9,33.72 62.1,33.52 v66.15,33.52
LPC_DQM1  (via drill 0.2)
  Top 0.125: IC5.39 v74.77,29.4 v74.76,29.39 | IC6.N9 54.91,37.8 55.29,38.18 55.29,40.7 55.6,41.01 55.6,44.07 55.6,44.23 v57.38,46
  Bottom 0.125: v74.76,29.39 74.73,29.39 74.57,29.55 74.57,34.35 74.04,34.89 74.05,40.43 68.54,45.93 57.58,45.95 57.38,45.95 v57.38,46
LPC_MCI_CD  (via drill 0.3)
  Top 0.125: IC6.B4 59.24,28.63 59.27,28.6 59.27,26.45 59.27,22.59
  Top 0.15: R20.2 66.34,11.65 66.4,12 66.3,12.1 66.3,12.9 66.3,13 v66.28,14.78 66.27,14.76 66.29,14.76 66.27,14.86 66.27,15.59 59.27,22.59 | v65.23,15.83 65.09,15.95 64.19,15.95 63.99,15.95 63.36,15.62 U1.SW_A
  Bottom 0.15: v66.28,14.78 v65.23,15.83
LPC_MCI_CLK
  Top 0.125: IC6.B6 56.86,28.57 56.85,9.05
  Top 0.15: U1.5 56.46,7.58 56.45,8.66 56.8,9 56.85,9.05
LPC_MCI_CMD  (via drill 0.2, 0.3)
  Top 0.125: 57.34,9.2 57.34,9.17
  Top 0.15: v65.5,4.3 66.4,4.3 66.5,4.4 66.5,4.9 R29.2 | 57.34,9.2 57.4,9.2 v57.4,9.1 57.3,9.2 57.2,9.3 57.2,28.1 IC6.A6 | v58.7,7.1 58.7,5.62 U1.3 58.64,5.55 v58.64,3.62
  Bottom 0.15: v65.5,4.3 64.64,3.43 59.44,3.43 59.38,3.43 58.83,3.43 v58.64,3.62 | v58.7,7.1 57.4,8.4 v57.4,9.1
LPC_MCI_DAT0  (via drill 0.3)
  Top 0.15: v50.92,7.5 50.63,7.8 50,7.8 49.9,7.9 49.9,8.5 R25.2 | v54.25,3.77 54.26,3.91 54.26,3.99 54.26,4.1 U1.7 | 58.2,8.7 58.19,8.7 | 58.2,8.7 58.2,18.6 58.05,18.78 58.05,28.08 IC6.A5 | 58.2,8.7 57.7,8.2 v57.7,7.4
  Bottom 0.15: 51.1,7.29 53.3,5 53.54,4.73 v54.25,3.77 | v50.92,7.5 51.1,7.29 | v57.7,7.4 50.95,7.41 51.1,7.29
LPC_MCI_DAT1  (via drill 0.3)
  Top 0.125: IC6.B5 57.66,28.55 v57.7,18.4
  Top 0.15: v49.91,5.18 49.9,6.4 R23.2 | U1.8 53.18,3.89 v53.16,3.76 53.2,11.1 53.7,11.6 v53.71,12.53 | v57.7,18.4 57.75,18.4
  Bottom 0.15: v49.91,5.18 51.07,3.76 v53.16,3.76 | v53.71,12.53 55.6,18.4 v57.7,18.4
LPC_MCI_DAT2  (via drill 0.2, 0.3)
  Top 0.125: IC6.C5 58.47,29.4 58.47,22.41
  Top 0.15: v66.5,3.6 66.5,2.5 R30.2 | v61.43,2.91 61.37,2.96 60.92,3.24 | 60.92,3.24 60.9,3.3 U1.1 60.92,3.24 | 60.92,3.24 60.92,7.06 v60.07,7.9 | 58.7,8 v58.7,7.9 58.7,8 | 58.7,8 58.7,8.01 | 58.7,8 58.6,8.1 58.6,8.8 58.6,8.87 58.6,18.77 58.49,18.93 58.49,22.13 58.48,22.42 58.47,22.41
  Bottom 0.15: v66.5,3.6 66.4,3.7 65.94,3.7 65.13,2.9 v61.43,2.91 | v60.07,7.9 v58.7,7.9
LPC_MCI_DAT3  (via drill 0.3)
  Top 0.125: IC6.A4 58.85,28.09 58.85,22.47
  Top 0.15: v66.5,6.1 66.5,7.2 R21.2 | U1.2 59.8,4.02 v59.79,3.95 59.8,7.1 59.28,7.62 59.28,7.94 59.28,8.58 59.28,9.15 59.35,9.22 59.51,9.38 59.51,20.34 58.85,20.93 58.85,22.38 58.85,22.47
  Bottom 0.15: v66.5,6.1 64.14,3.95 v59.79,3.95
LPC_RAS  (via drill 0.2)
  Top 0.125: 60.35,33.8 IC6.H2 v60.89,34.22 | IC5.18 63.55,27.8 v63.54,27.81
  Bottom 0.125: v63.54,27.81 62.42,27.82 60.68,29.58 60.6,29.97 59.79,30.78 59.8,32.91 | 59.8,32.91 59.79,32.92 | v60.89,34.22 60.89,34 59.8,32.91
LPC_RXD  (via drill 0.2, 0.3)
  Top 0.125: TP1.TP 34.33,28.34 v34.33,26.64
  Top 0.15: v52.1,39.1 52.4,38.8 52.4,38.6 IC6.P12 | v41.74,40.17 41.74,28.97 v41.61,28.88 | v34.33,26.64 34.3,26.42 34.3,26.2 34.3,25.8 IC7.26
  Bottom 0.15: v41.74,40.17 42.22,40.03 51.17,40.03 v52.1,39.1 | v41.61,28.88 39.6,26.6 v34.33,26.64
LPC_TXD  (via drill 0.2, 0.3)
  Top 0.125: IC6.N12 52.47,37.84 v52.08,38.23 | IC7.25 34.77,26.18 35.27,26.68 35.27,27.14 v35.51,27.38 35.51,27.85 TP2.TP
  Bottom 0.125: v52.08,38.23 52.5,37.82 52.45,36.34 51.97,35.92 51.27,36.69 50.39,36.69 43.75,29.94 38.07,29.94 v35.51,27.38
LPC_VBUS  (via drill 0.3)
  Top 0.15: 28.8,49.4 C10.2 | 28.81,51.45 R9.1 28.81,51.45 | v27.86,51.44 28.81,51.45
  Top 0.254: 28.8,49.4 28.8,50.9 28.8,51 28.81,51.45
  Bottom 0.15: v27.86,51.44 25.59,51.44 23.43,51.46 22.23,50.29 22.23,45.22 J3.1
LPC_WE  (via drill 0.2)
  Top 0.125: IC6.J2 60.55,34.59 60.55,34.67 v60.86,34.99 | IC5.16 63.15,29.4 62.92,29.17 v62.92,27.14 v62.91,27.13
  Bottom 0.125: v62.91,27.13 62.91,27.2 62.77,27.34 62.35,27.33 60.37,29.25 60.38,29.29 60.35,29.79 59.64,30.48 59.52,30.59 59.48,30.64 59.48,33.6 v60.86,34.98 v60.86,34.99
N$1
  Top 0.254: C34.2 28.51,68.41 R18.2 21.74,68.29 R22.2
N$3
  Top 0.15: LED1.C 43.1,10.9 43.1,8.4 43.2,8.3 43.1,8.2 R27.2
N$4  (via drill 0.5)
  Top 0.254: X2.3 10.19,7.33 11.64,8.78 11.64,10.71 12.76,11.83 22.45,11.83 29.49,18.85 29.49,21.7 v29.51,21.71 | v29.5,23.63 29.84,23.29 IC7.4
  Bottom 0.254: v29.51,21.71 v29.51,23.64 v29.5,23.63
N$5
  Top 0.254: X2.2 9.98,8.13 11.01,9.16 11.03,11.02 12.51,12.5 22.24,12.5 28.54,18.82 28.54,21.97 29.36,22.79 IC7.5
N$6
  Top 0.125: 50.77,39.45 50.04,39.45 50.04,39.02
N$7
  Top 0.254: R28.2 69.58,66.66 LED2.C
N$8
  Top 0.15: 51.12,60.63 51.12,60.03 IC2.3 | 50.92,63.43 L2.1
  Top 0.406: 51.12,60.63 50.92,60.83 50.92,63.43
N$9
  Top 0.125: IC6.N11 53.66,38.18 53.66,41.08
  Top 0.15: 53.66,41.08 53.44,41.29 53.39,41.34 53.38,46.79 54.3,47.72 54.3,49.19 54.7,49.19 R12.1
  Top 0.254: R12.1 R13.2
N$10
  Top 0.15: K1.1 19.15,43.18 19.63,43.66 19.63,45.16 J3.2
N$11
  Top 0.125: 61.37,27.34 61.68,27.34 61.74,27.34
N$12
  Top 0.125: 62.14,27.46 62.14,27.95
N$14
  Top 0.254: U3.10 43.48,61.41 R24.1
N$15
  Top 0.254: U3.1 42.12,55.55 42.71,54.97 43.44,54.97 C40.1
N$17  (via drill 0.5)
  Top 0.254: X2.1 9.26,8.93
  Top 0.305: 9.26,8.93 v10.03,9.7
  Bottom 0.305: v10.03,9.7 10.03,8.33 13.61,4.75 J4.3
N$18
  Top 0.15: IC6.A7 56.5,28.2 56.5,20.31 56.5,19.53 TP3.TP 55.44,17.69 55.38,17.65 54.99,16.54 52.88,16.54 50.5,16.53 50.05,16.08 50.05,14.64 R1.1
N$19
  Top 0.125: IC6.B8 55.26,28.31 55.26,27.92 55.37,27.84 55.37,27.33 54.88,26.84 54.88,26.13 54.88,25.89 55.97,24.8 55.97,20.45 TP4.TP
N$23
  Top 0.15: IC7.24 35.27,26.19 35.76,26.68 36.53,26.68 TP7.TP
N$26  (via drill 0.2, 0.3)
  Top 0.125: IC6.J10 54.05,34.59 53.68,34.25 v53.68,33.4
  Top 0.15: v47.24,31.77 47.15,31.7 47.09,31.69 47.05,31.67 46.39,31.67 46.11,31.67 45.91,31.67 44.41,31.67 R2.2
  Bottom 0.15: v53.68,33.4 53.3,33.8 49.53,33.8 47.6,31.77 v47.24,31.77
N$27
  Top 0.125: 37.6,38 37.6,38.2 R15.2
  Top 0.254: 37.6,38 37.6,36.03 SV1.4
  Bottom 0.125: SV1.4 37.5,36
  Bottom 0.15: SV1.4 37.5,36
N$28
  Top 0.15: R16.1 36.8,31 36.8,32.69 SV1.3
N$29
  Top 0.125: 51.67,37.83 51.28,38.18 51.29,42.25
  Top 0.15: IC6.N13 51.67,37.83 | 51.29,42.25 TP5.TP
N$30
  Top 0.15: 50.7,38.59 50.4,38.4 49.93,38.4 49.62,38.71 49.62,41.04 TP6.TP
  Top 0.254: 50.7,38.59 IC6.P14
N$31  (via drill 0.5)
  Top 0.254: U3.27 32.41,56.2 v31.89,55.68 | v25.37,57.44 23.58,57.44 22.63,56.49 22.63,54.91 X1.9
  Bottom 0.254: v31.89,55.68 27.13,55.68 v25.37,57.44
N$32
  Top 0.254: U3.14 43.17,64 43.48,64.31 R32.2
N$33  (via drill 0.5)
  Top 0.254: U3.26 31.96,56.85 v31.86,56.96
  Bottom 0.254: v31.86,56.96 31.86,60.72 32.56,61.42 32.56,63.47 31.83,64.2 24.55,64.21 X1.12
N$37
  Top 0.305: Q2.3 20.43,16.23 20.43,15.55 19.02,14.14 K4.13 13.35,15.94 13.35,23.69 14.34,24.68 D4.1 13.59,25.73 LED5.C
N$38
  Top 0.15: 53.02,54.53 52.62,54.53 R4.2 53.02,54.53 | 53.02,57.33 IC2.5 | 53.02,54.53 52.87,54.29
  Top 0.254: 52.69,54.53 52.52,54.53 50.42,54.53 R3.1 | 52.69,54.53 R4.2 | 53.02,54.53 53.02,57.33 | C7.2 52.69,54.53
N$39
  Top 0.254: LED5.A R34.1
N$40
  Top 0.406: K4.5 7.53,25.54 X5.1
N$44  (via drill 0.3)
  Top 0.125: IC6.A13 51.32,27.91 R19.2
  Top 0.254: C11.2 36.49,17.17 | 36.49,17.17 C30.2 | R19.2 45.27,21.72 v45.27,22.98 | v36.5,16.05 36.5,17.16 36.49,17.17
  Bottom 0.254: v45.27,22.98 43.43,22.98 v36.5,16.05
N$54  (via drill 0.2, 0.3)
  Top 0.125: v54.84,34.23 55.97,32.31 57.12,32.31 57.49,32.89 57.49,34.01 IC6.J5 | v48.01,33.03 47.73,33.31 47.52,33.31 45.82,33.3 R11.2
  Bottom 0.125: v54.84,34.23 49.08,34.22 v48.01,33.03
N$57  (via drill 0.2, 0.3)
  Top 0.125: IC6.L2 60.47,36.17 60.87,35.77 62.24,35.76 62.78,36.31 62.78,39.38 v61.54,40.62
  Top 0.15: R9.2 32.02,51.46 v32.74,50.74 | v52.09,47.18 52.09,44.39 v52.57,43.91
  Bottom 0.15: v61.54,40.62 55.91,40.62 53.92,42.61 52.62,43.91 v52.57,43.91 | v32.74,50.74 32.74,50.54 32.74,50.03 35.91,46.86 51.77,46.86 v52.09,47.18
N$67
  Top 0.15: IC3.3 60.36,60.08
  Top 0.254: 60.26,63.68 L3.1
  Top 0.406: 60.36,60.08 60.36,60.78 60.26,60.88 60.26,63.68
N$81
  Top 0.406: X6.1 72.41,53.47 C20.+ 72.06,54.15 74.66,56.75 IC8.1
N$132
  Top 0.254: R5.1 62.2,54.78 C8.2 | IC3.5 62.27,54.81 C8.2 | R6.2 62.29,54.83 C8.2
PWM_DATA  (via drill 0.2)
  Top 0.125: IC6.B9 v54.46,29.42
  Bottom 0.125: v54.46,29.42 53.3,28.12 52.48,28.12 46.48,28.09 46.05,27.62 | 33.71,8.5 32.4,7.19 J5.4
  Bottom 0.15: 46.05,27.62 33.71,15.28 33.71,8.5
RESET
  Top 0.125: IC6.H14 48.52,33.78 46.95,34.65 45.81,35.24 46.03,35.53 R17.1
  Top 0.15: R17.1 45.8,35.5 45.8,38.82 46.17,39.19 46.17,42.29 45.41,43.08 45.41,44.18 44.96,44.63 43.62,44.63 43.1,45.15 43.09,46.38 43.1,46.79 45.18,48.84 S3.2
  Top 0.305: S3.2 44.35,50.25
RIGHT
  Top 0.406: K4.7 2.45,21 X5.2
RX+  (via drill 0.5)
  Top 0.254: U3.13 39.52,63.35 v38.07,64.8 | X1.7 19.51,63.48 v22.75,66.72 22.92,66.59 R18.1
  Bottom 0.254: v38.07,64.8 37.77,65.1 35.13,67.73 23.8,67.74 v22.75,66.72
RX-  (via drill 0.5)
  Top 0.254: U3.12 38.36,62.7 v36.51,64.55 | R22.1 18.13,68.34 17.02,67.23 X1.8
  Bottom 0.254: v36.51,64.55 36.19,64.87 34.45,66.63 24.64,66.7 24.22,66.34 22.04,64.25 18.23,64.26 X1.8
SPEED
  Top 0.254: R31.2 26.93,64.05 X1.11
SPI_MISO  (via drill 0.2, 0.3)
  Top 0.125: IC6.C8 v55.36,30.1
  Top 0.15: U3.6 37.56,58.8 v37.14,58.38 | v24.91,13.14 26.04,13.14 28.62,10.56 28.62,8.62 J5.8
  Bottom 0.125: v55.36,30.1 55.36,27.92 55.36,27.36 54.61,26.61 52.42,24.48 52.43,23.95 52.43,23.34 | 33.21,4.97 29.75,4.97 J5.8
  Bottom 0.15: 52.43,23.34 34.04,4.97 33.21,4.97 | v37.14,58.38 37.13,54.94 35.84,53.67 26.56,53.67 25.02,52.13 20.98,52.13 15.76,46.91 15.76,25.75 21.38,20.13 21.38,16.67 v24.91,13.14
SPI_MOSI  (via drill 0.2, 0.3)
  Top 0.125: IC6.B7 56.45,29 56.08,28.63 56.06,27.46 | 56.06,25.99 56.04,25.91 v55.75,25.75
  Top 0.15: 56.06,27.46 56.06,27.19 56.06,25.99 | U3.7 37,59.45 v36.49,58.94 | v24.28,12.25 25.01,12.25 J5.7
  Bottom 0.125: v55.75,25.75 55.36,25.63 54.56,24.78 53.85,24.04 53.85,22.77 | 33.5,3.36 26.68,3.36 23.57,6.47 23.57,8.18 23.93,8.54 26,8.54 J5.7
  Bottom 0.15: 53.85,22.77 34.4,3.36 33.5,3.36 | v36.49,58.94 36.49,55.31 35.41,54.24 22.17,54.28 22.11,54.28 15.09,47.26 15.09,25.3 20.47,19.92 20.47,16.06 v24.28,12.25
SPI_SCK  (via drill 0.2, 0.3)
  Top 0.125: IC6.A8 55.67,26.9 v55.4,26.63
  Top 0.15: U3.8 36.39,60.1 v35.8,59.51 | J5.10 23.56,8.62 23.56,11.52 v23.48,11.6
  Bottom 0.125: v55.4,26.63 55.22,26.41 53.17,24.26 53.16,23.16 | 33.26,4.09 28.09,4.09 J5.10
  Bottom 0.15: 53.16,23.16 34.14,4.09 33.26,4.09 | v35.8,59.51 35.8,55.46 35.03,54.69 21.55,54.65 21.47,54.59 14.37,47.52 14.37,24.95 19.54,19.78 19.53,19.77 19.53,15.57 23.48,11.62 v23.48,11.6
SYSCLOCK_O  (via drill 0.3)
  Top 0.125: IC6.G13 51.26,32.59 50.13,32.6 48.59,30.93 48.29,30.58 45.98,30.58 45.81,30.58 v45.23,29.82
  Bottom 0.125: 45.04,29.79 v45.23,29.82 | J5.9 24.82,11.07
  Bottom 0.15: 45.04,29.79 45.04,29.71 27.69,12.46 26.21,12.46 24.82,11.07
TX+  (via drill 0.5)
  Top 0.254: R7.2 21.51,52.3 X1.1 | U3.17 32.05,62.7 v31.78,62.44
  Bottom 0.254: v31.78,62.44 30.39,62.44 26.8,58.85 24.05,58.85 X1.1
TX-  (via drill 0.5)
  Top 0.254: R8.2 16.44,55.05 X1.2 | U3.16 31.55,63.35 v31.42,63.48
  Bottom 0.254: v31.42,63.48 30.58,63.47 26.54,59.46 23.79,59.47 19.88,55.54 17.23,55.54 X1.2
USB_ID  (via drill 0.2, 0.3)
  Top 0.125: IC6.M1 61.27,36.97 62.04,36.99 62.12,37 v62.08,37 | v54.46,39.41 54.46,38.26 v54.51,38.2
  Top 0.15: JP1.2 28.09,36.03 v28.09,38.74
  Bottom 0.125: v62.08,37 61.22,36.55 60.25,35.68 58.67,34.29 57.16,34.29 56.53,34.45 56.45,35.61 55.79,35.92 55.21,36.26 54.06,36.29 53.77,37.62 54.35,38.2 v54.51,38.2 | 44.76,41.59 44.85,41.59 45.75,40.69 51.76,40.69 52.64,41.57 53.15,41.57 53.99,40.73 53.99,39.91 v54.46,39.41
  Bottom 0.15: 44.76,41.59 34.09,41.59 33.4,40.9 32.7,40.9 30.25,40.9 v28.09,38.74
XT1
  Top 0.254: C9.2 30.2,57.65 Q4.1 30.52,58.16 U3.24
XT2
  Top 0.254: U3.23 28.63,58.8 28.39,59.05 28.39,59.92 Q4.3 28.41,61.83 C6.2
XTAL1
  Top 0.125: IC6.A10 54.07,27.76 53.08,26.77 51.81,26.77 51.41,26.37 51.41,22.7 51.13,22.42 50.31,22.42 Q1.3 48.97,22.4 48.67,22.1 C43.2
XTAL2
  Top 0.125: IC6.B10 54.07,28.95 54.48,28.54 54.48,27.58 52.5,25.6 Q1.1 54.6,24.1 C41.2
(copper drawn outside any net)
  shapes: Top circle x1

## Text on the board
tPlace: Power | DC 7 - 12V | H | D | RST | GND | OUT | 3.3V | ELEKTOR | J1:USB | 120026-I | USB | 1 | 2 | 3 | J3: Host | Relais | J2:Boot | IO18 | GPA1|IO11|IO14|IO15 | 3V3 | SC | EXT | IO14 | MOSI | SCL | GPA3 | GPA0 | IO3 | LED1 | INT | GPA1 | GND | SCK | J5: HEADER | INT | J4: POWER | IO11 | SDA | PWM | Elektor Linux Board v2.0 | MISO
bPlace: GND | 3.3V | GPA1|IO11|IO14|IO15